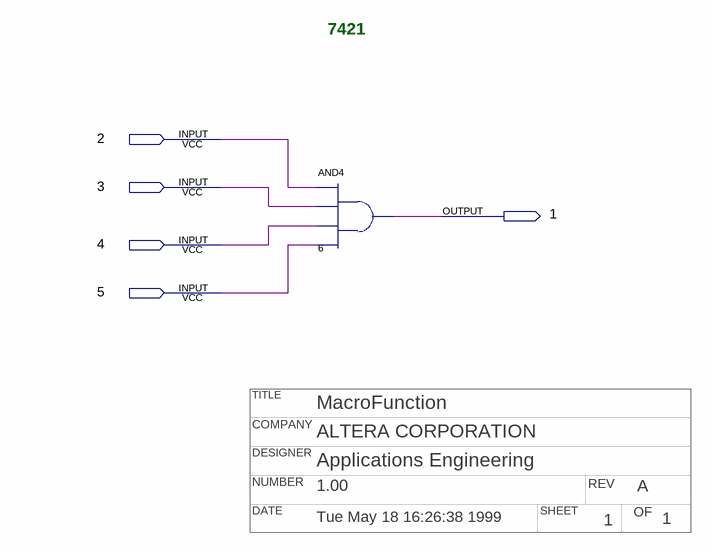
[diagram p0: schematic sheet]
// Quartus schematic 7421.bdf as structural Verilog: 1 symbols, 5 pins
// Title block: TITLE: MacroFunction; COMPANY: ALTERA CORPORATION; DESIGNER: Applications Engineering; NUMBER: 1.00; REV: A; DATE: Tue May 18 16:26:38 1999; SHEET: 1; OF: 1
module \7421  (
  input  \2 ,
  input  \3 ,
  input  \4 ,
  input  \5 ,
  output \1 
);

  and u_6 (\1 , \2 , \3 , \4 , \5 );

  // Notes on the sheet:
  //   7421
endmodule
